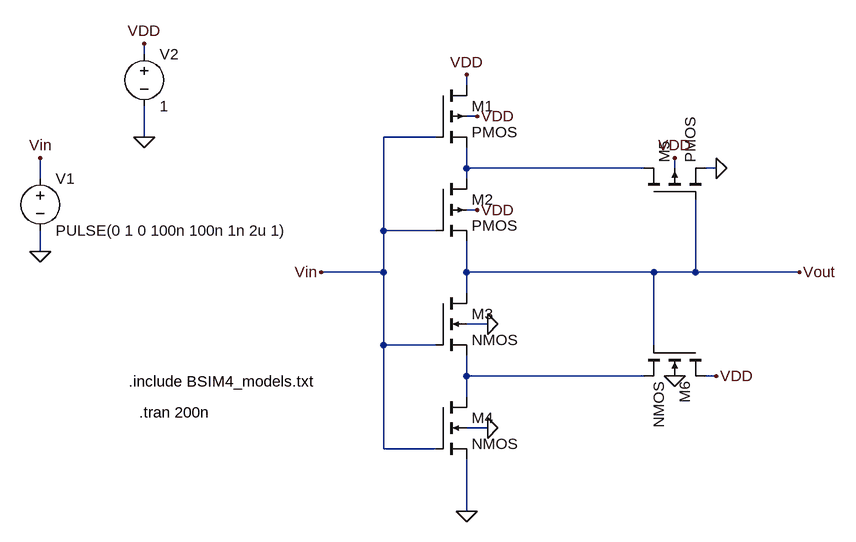
[diagram p0: schematic Schmitt Trigger.asc]
Schmitt Trigger.asc, the LTspice schematic file:
Version 4
SHEET 1 1012 896
WIRE -96 96 -96 80
WIRE 400 144 400 128
WIRE 416 192 400 192
WIRE -96 224 -96 176
WIRE 352 224 272 224
WIRE 400 272 400 240
WIRE 672 272 400 272
WIRE 720 272 720 256
WIRE 784 272 768 272
WIRE -256 288 -256 256
WIRE 400 288 400 272
WIRE 416 336 400 336
WIRE 272 368 272 224
WIRE 352 368 272 368
WIRE -256 400 -256 368
WIRE 272 432 272 368
WIRE 272 432 176 432
WIRE 400 432 400 384
WIRE 688 432 400 432
WIRE 752 432 752 320
WIRE 752 432 688 432
WIRE 912 432 752 432
WIRE 400 464 400 432
WIRE 432 512 400 512
WIRE 272 544 272 432
WIRE 352 544 272 544
WIRE 688 544 688 432
WIRE 400 592 400 560
WIRE 672 592 400 592
WIRE 784 592 768 592
WIRE 400 624 400 592
WIRE 432 672 400 672
WIRE 272 704 272 544
WIRE 352 704 272 704
WIRE 400 800 400 720
FLAG 912 432 Vout
FLAG 416 192 VDD
FLAG 416 336 VDD
FLAG 400 128 VDD
FLAG 720 256 VDD
FLAG 784 592 VDD
FLAG 400 800 0
FLAG 176 432 Vin
FLAG 432 672 0
FLAG 432 512 0
FLAG 784 272 0
FLAG 720 592 0
FLAG -96 224 0
FLAG -256 400 0
FLAG -256 256 Vin
FLAG -96 80 VDD
SYMBOL pmos4 352 144 R0
SYMATTR InstName M1
SYMATTR Value2 l=50n w=1.3u
SYMBOL pmos4 352 288 R0
SYMATTR InstName M2
SYMATTR Value2 l=50n w=1u
SYMBOL nmos4 352 464 R0
SYMATTR InstName M3
SYMATTR Value2 l=50n w=500n
SYMBOL nmos4 352 624 R0
SYMATTR InstName M4
SYMATTR Value2 l=50n w=500n
SYMBOL pmos4 672 320 R270
SYMATTR InstName M5
SYMATTR Value2 l=50n w=1u
SYMBOL nmos4 768 544 R90
SYMATTR InstName M6
SYMATTR Value2 l=50n w=1.125u
SYMBOL voltage -256 272 R0
SYMATTR InstName V1
SYMATTR Value PULSE(0 1 0 100n 100n 1n 2u 1)
SYMBOL voltage -96 80 R0
SYMATTR InstName V2
SYMATTR Value 1
TEXT -120 600 Left 2 !.include BSIM4_models.txt
TEXT -104 648 Left 2 !.tran 200n

The netlist it stands for:
* Schmitt Trigger.asc
M1 VDD Vin N001 VDD PMOS l=50n w=1.3u
M2 N001 Vin Vout VDD PMOS l=50n w=1u
M3 Vout Vin N002 0 NMOS l=50n w=500n
M4 N002 Vin 0 0 NMOS l=50n w=500n
M5 N001 Vout 0 VDD PMOS l=50n w=1u
M6 VDD Vout N002 0 NMOS l=50n w=1.125u
V1 Vin 0 PULSE(0 1 0 100n 100n 1n 2u 1)
V2 VDD 0 1
.model NMOS NMOS
.model PMOS PMOS
.lib standard.mos
.include BSIM4_models.txt
.tran 200n
.backanno
.end